# Altium project tms320f28388d_core_board.PrjPcb
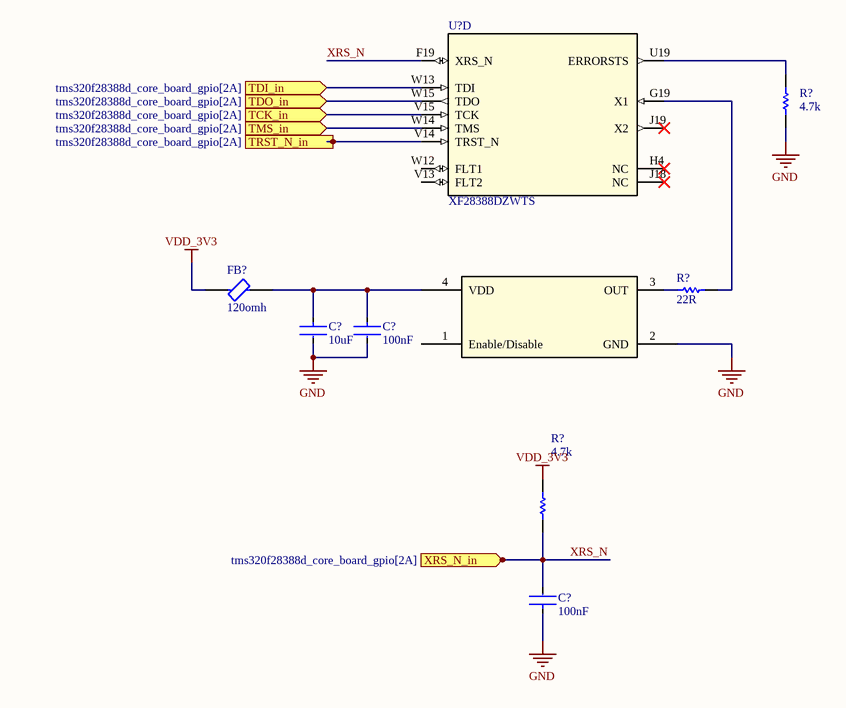
[diagram p0: tms320f28388d_core_board_support.SchDoc]
5 sheets, 167 parts. Net scope: flat (ports and power ports of the same name join across sheets).
Sheets:
  tms320f28388d_core_board_support.SchDoc
  tms320f28388d_core_board_adc.SchDoc
  tms320f28388d_core_board_gpio.SchDoc
  tms320f28388d_core_board_power.SchDoc
  tmf320f28388d_core_board_testpoint.SchDoc

## Sheet tms320f28388d_core_board_support.SchDoc
size A3; SheetNumber: 1; SheetTotal: 5

### Parts
(Parts that share a designator on the sheet are numbered #1, #2 ... from top to bottom, then left to right.)
C?#1  10uF  [FP-CC0402-MFG]
C?#2  100nF  [FP-CC0402-MFG]
C?#3  100nF  [FP-CC0402-MFG]
FB?#1  120omh  [FP-MMZ1005-MFG]
R?#1  4.7k  [FP-RT0402-MFG]
R?#2  22R  [FP-RC0402-0_4-IPC_A]
R?#3  4.7k  [FP-RT0402-MFG]
U?#1  XF28388DZWTS  [ZWT0337A-MFG]  (part D of 8)
X??  ot252020mjba4sl  [OSC-SMD_4P-L2.5-W2.0-BL]  (value not drawn)

### Ports
TCK_in (in, see tms320f28388d_core_board_gpio[2A]), TDI_in (in, see tms320f28388d_core_board_gpio[2A]), TDO_in (in, see tms320f28388d_core_board_gpio[2A]), TMS_in (in, see tms320f28388d_core_board_gpio[2A]), TRST_N_in (in, see tms320f28388d_core_board_gpio[2A]), XRS_N_in (in, see tms320f28388d_core_board_gpio[2A])

### Nets
GND: C?#1.2 C?#2.2 C?#3.1 R?#1.2 X??.2(GND)
VDD_3V3: FB?#1.1 R?#3.1
XRS_N: C?#3.2 R?#3.2 U?#1.F19(XRS_N) ; port XRS_N_in
NetC?#1_1: C?#1.1 C?#2.1 FB?#1.2 X??.4(VDD)
NetR?#1_1: R?#1.1 U?#1.U19(ERRORSTS)
NetR?#2_1: R?#2.1 X??.3(OUT)
NetR?#2_2: R?#2.2 U?#1.G19(X1)
NetU?#1_V14: U?#1.V14(TRST_N) ; port TRST_N_in
NetU?#1_V15: U?#1.V15(TCK) ; port TCK_in
NetU?#1_W13: U?#1.W13(TDI) ; port TDI_in
NetU?#1_W14: U?#1.W14(TMS) ; port TMS_in
NetU?#1_W15: U?#1.W15(TDO) ; port TDO_in

Not connected (* = marked no-connect by the designer): U?#1 H4(NC)* J18(NC)* J19(X2)* V13(FLT2) W12(FLT1); X?? 1(Enable/Disable)

### Library data of the parts
C?#1 = CL05A106MP5NUNC: CAP CER 10UF 10V X5R 0402; Manufacturer: Samsung; Temperature Coefficient: 15%; Tolerance: 20%; Material: Ceramic; Octopart: https://octopart.com/cl05a106mp5nunc-samsung-22457395; Voltage Rating: 10V; RoHS: TRUE; Value: 10uF; Height: 0.7mm; Digikey Description: CAP CER 10UF 10V X5R 0402; Automotive: No; Package: CL05A106MP5NUNC; Device Class L1: Passive Components; Capacitance: 10uF; Temperature Range High: +85°C; ComponentLink2Description: Datasheet; Device Class L2: Capacitors; Temperature Characteristic: X5R; Manufacturer Part Number: CL05A106MP5NUNC; Temperature: -55°C to +85°C; ComponentLink2URL: http://www.samsungsem.com/kr/support/product-search/mlcc/__icsFiles/afieldfile/2019/05/10/19-CL05A106MP5NUNC.pdf; Device Class L3: Ceramic Capacitors; Category: Cap; Temperature Range Low: -55°C; Ipc Land Pattern Name: CAPC10050X50; Lead Free: Yes
C?#2 C?#3 = CC0402KRX7R7BB104: CAP CER 0.1UF 16V X7R 0402; Manufacturer: YAGEO; Material: Ceramic; Automotive Grade: NA; Temperature Coefficient: 30ppm/°C; Tolerance: 0.1; Device Class L1: Passive Components; Temperature Range Low: -55°C; Device Class L3: Ceramic Capacitors; Temperature Characteristic: X7R; Ipc Land Pattern Name: CAPC10050X50; Capacitance: 100 nF; Temperature Range High: +125°C; Voltage Rating: 16 V; Temperature: -55°C to +125°C; RoHS: TRUE; Automotive: No; Height: 0.55mm; Device Class L2: Capacitors; Digikey Description: CAP CER 0.1UF 16V X7R 0402; Package: CC0402; Footprint Url: http://www.yageo.com/exep/pages/download/literatures/UPY-C_GEN_24.pdf; ComponentLink2Description: Datasheet; Category: Cap; Lead Free: Yes; Value: 100 nF; Octopart: https://octopart.com/cc0402krx7r7bb104-yageo-42244624; ComponentLink2URL: http://www.yageo.com/documents/recent/UPY-GP_NP0_16V-to-50V_16.pdf; Manufacturer Part Number: CC0402KRX7R7BB104; Mouser Description: 0402 0.1 uF 16 V ±10 % Tolerance X7R SMT Multilayer Ceramic Capacitor
FB?#1 = MMZ1005S121CT000: Signal Line Ferrite Bead 120Ω @ 100MHz 500mA DCR 220mΩ SMD 0402; DC Resistance (DCR): 250mR; Tolerance: 25%; Impedance: 120R; Series: MMZ; Height: 0.022inch; RoHS Compliant: Yes; Package Quantity: 1; REACH SVHC: No SVHC; Lead Free: Lead Free; Current Rating: 500mA; Packaging: Tape and Reel; Case Code (Imperial): 0402; Width: 0.02inch; Max DC Current: 500mA; Core Material: Ferrite; Case Code (Metric): 1005; Depth: 0.5mm; Case/Package: 0402; Mount: Surface Mount; Length: 0.039inch
R?#1 R?#3 = RT0402BRD074K7L: RES SMD 4.7K OHM 0.1% 1/16W 0402; Manufacturer: Yageo; Voltage Rating: 50V; Temperature Coefficient: 25 ppm/°C; Resistance: 4.7KΩ; Tolerance: 0.001; Power Rating: 0.063W; Value: 4.7KΩ; Device Class L2: Resistors; Composition: Thin Film; Octopart: https://octopart.com/rt0402brd074k7l-yageo-1415343; Mouser Description: Thin Film Resistors 1/16W 4.7K ohm .1% 25ppm; Lead Free: Yes; Height: 0.35mm; Automotive: No; Series: RT; Ipc Land Pattern Name: RESC10050X30; Package: RT0402; Category: Res; Temperature Range High: +155°C; Footprint Url: http://www.yageo.com/exep/pages/download/literatures/PYu-R_Mount_10.pdf; Temperature Range Low: -55°C; Device Class L3: Chip SMD Resistors; Manufacturer Part Number: RT0402BRD074K7L; RoHS: TRUE; ComponentLink2URL: http://www.yageo.com/documents/recent/PYu-RT_1-to-0.01_RoHS_L_9.pdf; Digikey Description: RES SMD 4.7K OHM 0.1% 1/16W 0402; Temperature: -55°C to +155°C; Device Class L1: Passive Components; ComponentLink2Description: Datasheet
R?#2 = CMP-2002-07520-2: Tolerance: 1%; Power Rating: 63mW; Voltage Rating: 50V; Temperature Coefficient: 100ppm/°C; Resistance: 22Ω; Termination: SMD/SMT; Depth: 500µm; Packaging: Tape & Reel; Height: 400µm; Width: 500µm; Case Code (Imperial): 0402; Length: 1mm; Schedule B: 8533210045, 8533210045|8533210045|8533210045|8533210045|8533210045|8533210045|8533210045|8533210045, 8533210045|8533210045|8533210045|8533210045|8533210045|8533210045|8533210045|8533210045|8533210045, 8533210045|8533210045|8533210045|8533210045|8533210045|8533210045|8533210045|8533210045|8533210045|8533210045; Case/Package: 0402; Max Operating Temperature: 155°C; Min Operating Temperature: -55°C; REACH SVHC: Unknown; RoHS: Compliant; Military Standard: Not; Voltage Rating (DC): 50V; Lead Free: Lead Free; Voltage Rating (AC): 50V; Number of Pins: 2; Composition: Thick Film
U?#1 = XF28388DZWTS: C2000 32-bit MCU w/ connectivity manager, 2x C28x+CLA CPU, 1.5 MB flash, FPU64, CLB, ENET, EtherCAT 337-NFBGA -40 to 125; Manufacturer_Name: Texas Instruments; TYPE: TYPE; RefDes: RefDes; Copyright: Copyright (C) 2026 Ultra Librarian. All rights reserved.; Manufacturer_Part_Number: XF28388DZWTS
X?? = OT252020MJBA4SL: 频率:20MHz;常温频差:±10ppm;输出模式:CMOS;工作电压:1.8V~3.3V;工作电流:4mA;频率稳定度:±20ppm;; Manufacturer: YXC(扬兴晶振); AddInBom: yes; ModelId: 6c59bf18646c482ead3932fe5df36485; ModelName: OSC-SMD_4P-L2.5-W2.0-H0.6; ModelTransform: 98.425,78.74,0,0,0,0,0.0005,0,0; Value: 20MHz; Normal temperature Frequency Tolerance: ±10ppm; Output Type: CMOS; Current - Supply: 4mA; Frequency Stability: ±20ppm; Symbol: OT252020MJBA4SL; LCSC Part Name: YSO110TR 20MHZ 1.8V-3.3V ±10PPM -40~85℃（±20PPM) CMOS; SupplierPart: C669067; ManufacturerPart: OT252020MJBA4SL; Supplier Footprint: SMD2520-4P; JLCPCB Part Class: Extended Part; Datasheet: https://item.szlcsc.com/datasheet/OT252020MJBA4SL/699167.html; Supplier: LCSC; ConvertToPcb: yes; FootprintName: OSC-SMD_4P-L2.5-W2.0-BL; Voltage - Supply: 1.8V~3.3V; Operating Temperature: -40℃~+85℃

## Sheet tms320f28388d_core_board_adc.SchDoc
size A3; SheetNumber: 2; SheetTotal: 5
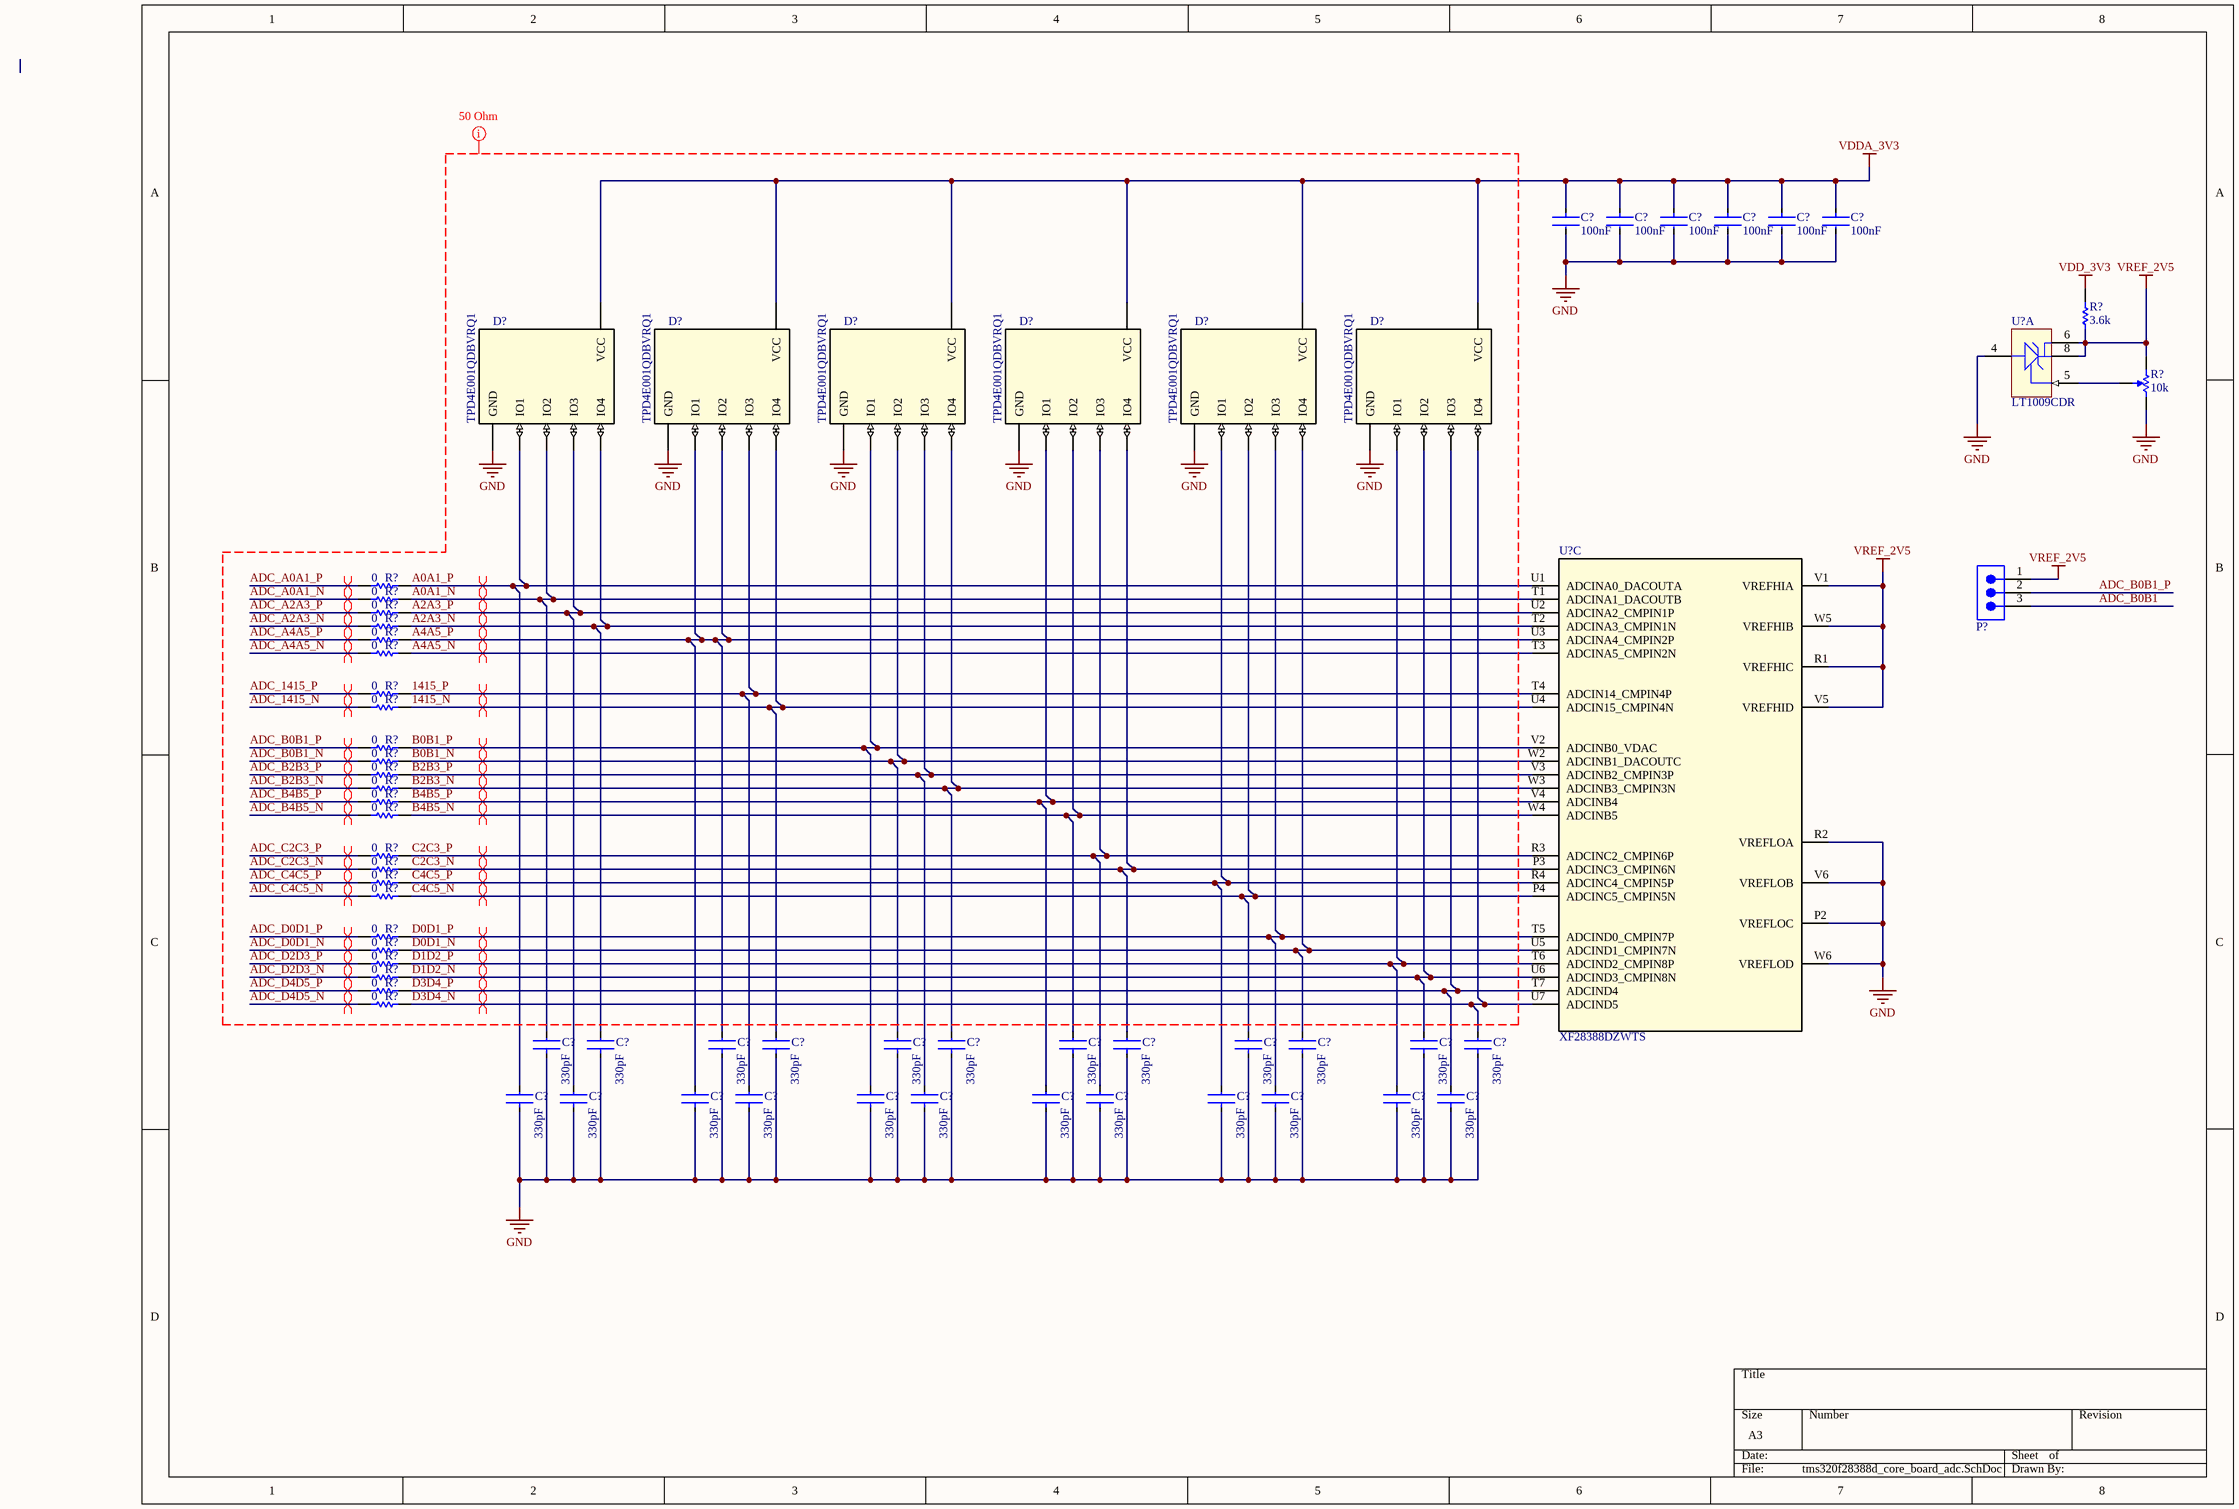
[diagram p1: tms320f28388d_core_board_adc.SchDoc]

### Parts
(Parts that share a designator on the sheet are numbered #1, #2 ... from top to bottom, then left to right.)
C?#4  100nF  [FP-CC0402-MFG]
C?#5  100nF  [FP-CC0402-MFG]
C?#6  100nF  [FP-CC0402-MFG]
C?#7  100nF  [FP-CC0402-MFG]
C?#8  100nF  [FP-CC0402-MFG]
C?#9  100nF  [FP-CC0402-MFG]
C?#10  330pF  [FP-GRM155-0_05-MFG]
C?#11  330pF  [FP-GRM155-0_05-MFG]
C?#12  330pF  [FP-GRM155-0_05-MFG]
C?#13  330pF  [FP-GRM155-0_05-MFG]
C?#14  330pF  [FP-GRM155-0_05-MFG]
C?#15  330pF  [FP-GRM155-0_05-MFG]
C?#16  330pF  [FP-GRM155-0_05-MFG]
C?#17  330pF  [FP-GRM155-0_05-MFG]
C?#18  330pF  [FP-GRM155-0_05-MFG]
C?#19  330pF  [FP-GRM155-0_05-MFG]
C?#20  330pF  [FP-GRM155-0_05-MFG]
C?#21  330pF  [FP-GRM155-0_05-MFG]
C?#22  330pF  [FP-GRM155-0_05-MFG]
C?#23  330pF  [FP-GRM155-0_05-MFG]
C?#24  330pF  [FP-GRM155-0_05-MFG]
C?#25  330pF  [FP-GRM155-0_05-MFG]
C?#26  330pF  [FP-GRM155-0_05-MFG]
C?#27  330pF  [FP-GRM155-0_05-MFG]
C?#28  330pF  [FP-GRM155-0_05-MFG]
C?#29  330pF  [FP-GRM155-0_05-MFG]
C?#30  330pF  [FP-GRM155-0_05-MFG]
C?#31  330pF  [FP-GRM155-0_05-MFG]
C?#32  330pF  [FP-GRM155-0_05-MFG]
C?#33  330pF  [FP-GRM155-0_05-MFG]
D?#1  TPD4E001QDBVRQ1  [FP-DBV0006A-MFG]
D?#2  TPD4E001QDBVRQ1  [FP-DBV0006A-MFG]
D?#3  TPD4E001QDBVRQ1  [FP-DBV0006A-MFG]
D?#4  TPD4E001QDBVRQ1  [FP-DBV0006A-MFG]
D?#5  TPD4E001QDBVRQ1  [FP-DBV0006A-MFG]
D?#6  TPD4E001QDBVRQ1  [FP-DBV0006A-MFG]
P?#1  TSW-103-07-G-S  [SMTC-TSW-103-07-X-S]  (value not drawn)
R?#4  3.6k  [RESC1005X40X25ML05T10]
R?#5  10k  [BOUR-TC33X-2_V]
R?#6  0  [FP-RC0402-0_4-MFG]
R?#7  0  [FP-RC0402-0_4-MFG]
R?#8  0  [FP-RC0402-0_4-MFG]
R?#9  0  [FP-RC0402-0_4-MFG]
R?#10  0  [FP-RC0402-0_4-MFG]
R?#11  0  [FP-RC0402-0_4-MFG]
R?#12  0  [FP-RC0402-0_4-MFG]
R?#13  0  [FP-RC0402-0_4-MFG]
R?#14  0  [FP-RC0402-0_4-MFG]
R?#15  0  [FP-RC0402-0_4-MFG]
R?#16  0  [FP-RC0402-0_4-MFG]
R?#17  0  [FP-RC0402-0_4-MFG]
R?#18  0  [FP-RC0402-0_4-MFG]
R?#19  0  [FP-RC0402-0_4-MFG]
R?#20  0  [FP-RC0402-0_4-MFG]
R?#21  0  [FP-RC0402-0_4-MFG]
R?#22  0  [FP-RC0402-0_4-MFG]
R?#23  0  [FP-RC0402-0_4-MFG]
R?#24  0  [FP-RC0402-0_4-MFG]
R?#25  0  [FP-RC0402-0_4-MFG]
R?#26  0  [FP-RC0402-0_4-MFG]
R?#27  0  [FP-RC0402-0_4-MFG]
R?#28  0  [FP-RC0402-0_4-MFG]
R?#29  0  [FP-RC0402-0_4-MFG]
U?#2  LT1009CDR  [D0008A_N]  (part A of 2)
U?#3  XF28388DZWTS  [ZWT0337A-MFG]  (part C of 8)

### Nets
GND: C?#4.2 C?#5.2 C?#6.2 C?#7.2 C?#8.2 C?#9.2 C?#10.1 C?#11.1 C?#12.1 C?#13.1 C?#14.1 C?#15.1 C?#16.1 C?#17.1 C?#18.1 C?#19.1 C?#20.1 C?#21.1 C?#22.1 C?#23.1 C?#24.1 C?#25.1 C?#26.1 C?#27.1 C?#28.1 C?#29.1 C?#30.1 C?#31.1 C?#32.1 C?#33.1 D?#1.2(GND) D?#2.2(GND) D?#3.2(GND) D?#4.2(GND) D?#5.2(GND) D?#6.2(GND) R?#5.3 U?#2.4(ANODE) U?#3.P2(VREFLOC) U?#3.R2(VREFLOA) U?#3.V6(VREFLOB) U?#3.W6(VREFLOD)
VDD_3V3: R?#4.2
VDDA_3V3: C?#4.1 C?#5.1 C?#6.1 C?#7.1 C?#8.1 C?#9.1 D?#1.5(VCC) D?#2.5(VCC) D?#3.5(VCC) D?#4.5(VCC) D?#5.5(VCC) D?#6.5(VCC)
VREF_2V5: P?#1.1 R?#4.1 R?#5.1 U?#2.6(CATHODE) U?#2.8(CATHODE) U?#3.R1(VREFHIC) U?#3.V1(VREFHIA) U?#3.V5(VREFHID) U?#3.W5(VREFHIB)
1415_N: C?#13.2 D?#2.6(IO4) R?#13.2 U?#3.U4(ADCIN15_CMPIN4N)
1415_P: C?#25.2 D?#2.4(IO3) R?#12.2 U?#3.T4(ADCIN14_CMPIN4P)
A0A1_N: C?#10.2 D?#1.3(IO2) R?#7.2 U?#3.T1(ADCINA1_DACOUTB)
A0A1_P: C?#22.2 D?#1.1(IO1) R?#6.2 U?#3.U1(ADCINA0_DACOUTA)
A2A3_N: C?#11.2 D?#1.6(IO4) R?#9.2 U?#3.T2(ADCINA3_CMPIN1N)
A2A3_P: C?#23.2 D?#1.4(IO3) R?#8.2 U?#3.U2(ADCINA2_CMPIN1P)
A4A5_N: R?#11.2 U?#3.T3(ADCINA5_CMPIN2N)
A4A5_P: C?#12.2 C?#24.2 D?#2.1(IO1) D?#2.3(IO2) R?#10.2 U?#3.U3(ADCINA4_CMPIN2P)
ADC_1415_N: R?#13.1
ADC_1415_P: R?#12.1
ADC_A0A1_N: R?#7.1
ADC_A0A1_P: R?#6.1
ADC_A2A3_N: R?#9.1
ADC_A2A3_P: R?#8.1
ADC_A4A5_N: R?#11.1
ADC_A4A5_P: R?#10.1
ADC_B0B1: P?#1.3
ADC_B0B1_N: R?#15.1
ADC_B0B1_P: P?#1.2 R?#14.1
ADC_B2B3_N: R?#17.1
ADC_B2B3_P: R?#16.1
ADC_B4B5_N: R?#19.1
ADC_B4B5_P: R?#18.1
ADC_C2C3_N: R?#21.1
ADC_C2C3_P: R?#20.1
ADC_C4C5_N: R?#23.1
ADC_C4C5_P: R?#22.1
ADC_D0D1_N: R?#25.1
ADC_D0D1_P: R?#24.1
ADC_D2D3_N: R?#27.1
ADC_D2D3_P: R?#26.1
ADC_D4D5_N: R?#29.1
ADC_D4D5_P: R?#28.1
B0B1_N: C?#14.2 D?#3.3(IO2) R?#15.2 U?#3.W2(ADCINB1_DACOUTC)
B0B1_P: C?#26.2 D?#3.1(IO1) R?#14.2 U?#3.V2(ADCINB0_VDAC)
B2B3_N: C?#15.2 D?#3.6(IO4) R?#17.2 U?#3.W3(ADCINB3_CMPIN3N)
B2B3_P: C?#27.2 D?#3.4(IO3) R?#16.2 U?#3.V3(ADCINB2_CMPIN3P)
B4B5_N: C?#16.2 D?#4.3(IO2) R?#19.2 U?#3.W4(ADCINB5)
B4B5_P: C?#28.2 D?#4.1(IO1) R?#18.2 U?#3.V4(ADCINB4)
C2C3_N: C?#17.2 D?#4.6(IO4) R?#21.2 U?#3.P3(ADCINC3_CMPIN6N)
C2C3_P: C?#29.2 D?#4.4(IO3) R?#20.2 U?#3.R3(ADCINC2_CMPIN6P)
C4C5_N: C?#18.2 D?#5.3(IO2) R?#23.2 U?#3.P4(ADCINC5_CMPIN5N)
C4C5_P: C?#30.2 D?#5.1(IO1) R?#22.2 U?#3.R4(ADCINC4_CMPIN5P)
D0D1_N: C?#19.2 D?#5.6(IO4) R?#25.2 U?#3.U5(ADCIND1_CMPIN7N)
D0D1_P: C?#31.2 D?#5.4(IO3) R?#24.2 U?#3.T5(ADCIND0_CMPIN7P)
D1D2_N: C?#20.2 D?#6.3(IO2) R?#27.2 U?#3.U6(ADCIND3_CMPIN8N)
D1D2_P: C?#32.2 D?#6.1(IO1) R?#26.2 U?#3.T6(ADCIND2_CMPIN8P)
D3D4_N: C?#21.2 D?#6.6(IO4) R?#29.2 U?#3.U7(ADCIND5)
D3D4_P: C?#33.2 D?#6.4(IO3) R?#28.2 U?#3.T7(ADCIND4)
NetR?#5_2: R?#5.2 U?#2.5(ADJ)

### Layout directives
differential pair: 1415_N, 1415_P, A0A1_N, A0A1_P, A2A3_N, A2A3_P, A4A5_N, A4A5_P, ADC_1415_N, ADC_1415_P, ADC_A0A1_N, ADC_A0A1_P, ADC_A2A3_N, ADC_A2A3_P, ADC_A4A5_N, ADC_A4A5_P, ADC_B0B1_N, ADC_B0B1_P, ADC_B2B3_N, ADC_B2B3_P, ADC_B4B5_N, ADC_B4B5_P, ADC_C2C3_N, ADC_C2C3_P, ADC_C4C5_N, ADC_C4C5_P, ADC_D0D1_N, ADC_D0D1_P, ADC_D2D3_N, ADC_D2D3_P, ADC_D4D5_N, ADC_D4D5_P, B0B1_N, B0B1_P, B2B3_N, B2B3_P, B4B5_N, B4B5_P, C2C3_N, C2C3_P, C4C5_N, C4C5_P, D0D1_N, D0D1_P, D1D2_N, D1D2_P, D3D4_N, D3D4_P
mark named 50 Ohm: 1415_N, 1415_P, A0A1_N, A0A1_P, A2A3_N, A2A3_P, A4A5_N, A4A5_P, ADC_1415_N, ADC_1415_P, ADC_A0A1_N, ADC_A0A1_P, ADC_A2A3_N, ADC_A2A3_P, ADC_A4A5_N, ADC_A4A5_P, ADC_B0B1_N, ADC_B0B1_P, ADC_B2B3_N, ADC_B2B3_P, ADC_B4B5_N, ADC_B4B5_P, ADC_C2C3_N, ADC_C2C3_P, ADC_C4C5_N, ADC_C4C5_P, ADC_D0D1_N, ADC_D0D1_P, ADC_D2D3_N, ADC_D2D3_P, ADC_D4D5_N, ADC_D4D5_P, B0B1_N, B0B1_P, B2B3_N, B2B3_P, B4B5_N, B4B5_P, C2C3_N, C2C3_P, C4C5_N, C4C5_P, D0D1_N, D0D1_P, D1D2_N, D1D2_P, D3D4_N, D3D4_P, GND

### Library data of the parts
C?#4-C?#9 = CC0402KRX7R7BB104: as C?#2 on sheet tms320f28388d_core_board_support; Device Class L1: Passive Components; Temperature Range Low: -55°C; Device Class L3: Ceramic Capacitors; Temperature Characteristic: X7R; Ipc Land Pattern Name: CAPC10050X50; Capacitance: 100 nF; Temperature Range High: +125°C; Voltage Rating: 16 V; Temperature: -55°C to +125°C; RoHS: TRUE; Automotive: No; Height: 0.55mm; Device Class L2: Capacitors; Digikey Description: CAP CER 0.1UF 16V X7R 0402; Package: CC0402; Footprint Url: http://www.yageo.com/exep/pages/download/literatures/UPY-C_GEN_24.pdf; ComponentLink2Description: Datasheet; Category: Cap; Lead Free: Yes; Value: 100 nF; Octopart: https://octopart.com/cc0402krx7r7bb104-yageo-42244624; ComponentLink2URL: http://www.yageo.com/documents/recent/UPY-GP_NP0_16V-to-50V_16.pdf; Manufacturer Part Number: CC0402KRX7R7BB104; Mouser Description: 0402 0.1 uF 16 V ±10 % Tolerance X7R SMT Multilayer Ceramic Capacitor
C?#10-C?#33 = GRM1555C1H331JA01D: Chip Multilayer Ceramic Capacitors for General Purpose, 0402, 330pF, C0G, 30ppm/°C, 5%, 50V; Insulation Resistance: 10GR; REACH SVHC: No SVHC; Depth: 0.5mm; Voltage Rating (DC): 50V; Number of Pins: 2; Max Operating Temperature: 125°C; Dielectric: C0G; Tolerance: 5%; Package Quantity: 1; Length: 1mm; Thickness: 0.022inch; Case/Package: 0402; Lead Free: Lead Free; Case Code (Imperial): 0402; Material: Ceramic; Voltage Rating: 50V; Voltage: 50V; Radiation Hardening: No; Min Operating Temperature: -55°C; Packaging: Tape and Reel; Capacitance: 330pF; Case Code (Metric): 1005; Width: 0.5mm; Mount: Surface Mount; Height: 0.5mm; Temperature Coefficient: 30ppm/°C; Termination: SMD/SMT
D?#1-D?#6 = TPD4E001QDBVRQ1: TVS DIODE 5.5V 16V SOT23-6; Power Line Protection: Yes; Breakdown Voltage: 11V; Peak Pulse Power: 100W; Number of Channels: 4; Peak Pulse Current: 5.5A; Current Rating: 1nA; Forward Voltage: 950mV; Direction: Unidirectional; Capacitance: 1.5pF; Leakage Current: 200nA; Interface: LVDS; Operating Supply Voltage: 5.5V; Number of Pins: 6; Lead Free: Lead Free; Max Operating Temperature: 125°C; Length: 3.05mm; RoHS Compliant: Yes; Reverse Standoff Voltage: 5.5V; Depth: 1.75mm; Mount: Surface Mount; Termination: SMD/SMT; Radiation Hardening: No; Min Breakdown Voltage: 11V; Max Power Dissipation: 100W; Clamping Voltage: 16V; Case/Package: SOT-23-6; Min Operating Temperature: -40°C; Packaging: Tape and Reel; Package Quantity: 3000; Working Voltage: 5.5V; Number of Bidirectional Channels: 4; Polarity: Unidirectional
P?#1 = TSW-103-07-G-S: 0.025" SQ Post Header, Through-hole, Vertical, -55 to 125 degC, 2.54 mm Pitch, 3-Pin, Male, RoHS; Manufacturer: Samtec; Pitch: 2.54 mm; ComponentLink3URL: http://www.samtec.com/documents/webfiles/cpdf/TSW-XXX-XX-XXX-X-XX-XXX-MKT.pdf; Temperature Range: -55 to 125 degC; DatasheetVersion: F-214; ComponentLink1Description: Manufacturer URL; ComponentLink2URL: http://www.samtec.com/documents/webfiles/pdf/TSW_TH.PDF; RoHS: True; Orientation: Vertical; ComponentLink2Description: Datasheet; ComponentLink3Description: Package Specification; PackageDescription: .025[0.64] SQ. Post Terminal Strip Assembly; Mounting Technology: Through-hole; PackageVersion: DM, 8/1988; ComponentLink1URL: http://www.samtec.com; PackageReference: TSW-103-07-X-S; PartNumber: TSW-103-07-G-S
R?#4 = RC0402FR-073K6L: Manufacturer: Yageo / Phycomp; Part Number: RC0402FR-073K6L
R?#5 = TC33X-2-103E: Trimming Potentiometer, 10000 Ohm, -40 to 100 degC, 3-Pin SMD, RoHS, Tape and Reel; Manufacturer: Bourns; Tolerance: 25%; Max Power Dissipation: 100mW; Number of Turns: 1; Resistance: 10KOhm; Temperature Coefficient: 250ppm/degreesC; Voltage Rating (DC): 50V; Datasheet URL: http://www.bourns.com/docs/Product-Datasheets/TC33.pdf; Composition: Potentiometer; Package Description: 3-Pin Surface Mount Device, Body 3.8 x 3.6 mm; Weight: 29.4mg; Power Rating: 100mW; Termination: FootPrint; Manufacturer URL: http://www.bourns.com/; Width: 0.118inch; Height: 0.047inch; Military Standard: Not; Radiation Hardening: No; Colour: Silver; Case/Package: SMD/SMT; Depth: 3.8mm; Min Operating Temperature: -40degC; Lead Free: LeadFree; Datasheet Version: 42583.0; REACH SVHC: NoSVHC; Length: 3mm; RoHSCompliant: true; Contact Plating: Silver; Taper: Linear; Packaging: TapeandReel; Mount: SurfaceMount; Max Operating Temperature: 100degC; Package Reference: TC33X-2; Package Quantity: 2500
R?#6-R?#29 = RC0402FR-070RL: RES SMD 0 OHM JUMPER 1/16W 0402; Resistance: 0R; Temperature Coefficient: 200ppm/°C; Tolerance: 1%; Power Rating: 62.5mW; Voltage Rating: 50V; Max Power Dissipation: 63mW; Features: Moisture Resistant; Length: 1mm; Case Code (Metric): 1005; Series: RC; RoHS Compliant: Yes; Resistor Type: Thick Film; Height: 0.35mm; Min Operating Temperature: -55°C; Case Code (Imperial): 0402; Number of Terminations: 2; Contact Plating: Tin; Case/Package: 0402; Size Code: 0402; Termination: SMD/SMT; Max Operating Temperature: 155°C; Width: 0.5mm; Mount: Surface Mount; Lead Free: Lead Free; Packaging: Tape and Reel; Radiation Hardening: No
U?#2 = LT1009CDR: Integrated Reference Circuit, 2.5 V, 15 ppm / degC, 10 mA, 0 to 70 degC, 8-pin SOIC (D), Green (RoHS & no Sb/Br); Manufacturer: Texas Instruments; VO(V): 2.5; Initial Accuracy @ 25/deg C(%): 0.2; SubFamily: Shunt Voltage Reference; Temp Coeff(Typ)(ppm/ degree C): 15; Min Iz for Regulation(uA): 400; Rating: Catalog; Iout/Iz(Max)(mA): 10; Temp Coeff(Max)(ppm/ degree C): 25; ComponentLink3Description: Package Specification; ComponentLink1URL: http://www.ti.com/; ComponentLink2URL: http://www.ti.com/general/docs/lit/getliterature.tsp?genericPartNumber=LT1009&fileType=pdf; DatasheetVersion: SLVS013N; PackageDescription: 8-Pin Plastic Small Outline, Body 4.9 x 3.9 mm, Pitch 1.27 mm; ComponentLink1Description: Manufacturer URL; PackageReference: D0008A; ComponentLink2Description: Datasheet; PartNumber: LT1009CDR; Mounting Technology: Surface Mount; Eco-Plan: Green (RoHS & no Sb/Br); PackageVersion: 4040047-3/M; Code_JEDEC: MS-012; ComponentLink3URL: http://www.ti.com/litv/pdf/msoi002j
U?#3 = XF28388DZWTS: as U?#1 on sheet tms320f28388d_core_board_support; TYPE: TYPE; RefDes: RefDes; Copyright: Copyright (C) 2026 Ultra Librarian. All rights reserved.; Manufacturer_Part_Number: XF28388DZWTS

## Sheet tms320f28388d_core_board_gpio.SchDoc
size A3; SheetNumber: 3; SheetTotal: 5
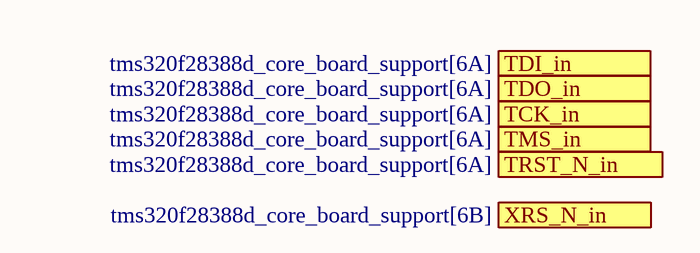
[diagram p2: tms320f28388d_core_board_gpio.SchDoc]

### Ports
TCK_in (out, see tms320f28388d_core_board_support[6A]), TDI_in (out, see tms320f28388d_core_board_support[6A]), TDO_in (out, see tms320f28388d_core_board_support[6A]), TMS_in (out, see tms320f28388d_core_board_support[6A]), TRST_N_in (out, see tms320f28388d_core_board_support[6A]), XRS_N_in (out, see tms320f28388d_core_board_support[6B])

## Sheet tms320f28388d_core_board_power.SchDoc
size A3; SheetNumber: 4; SheetTotal: 5
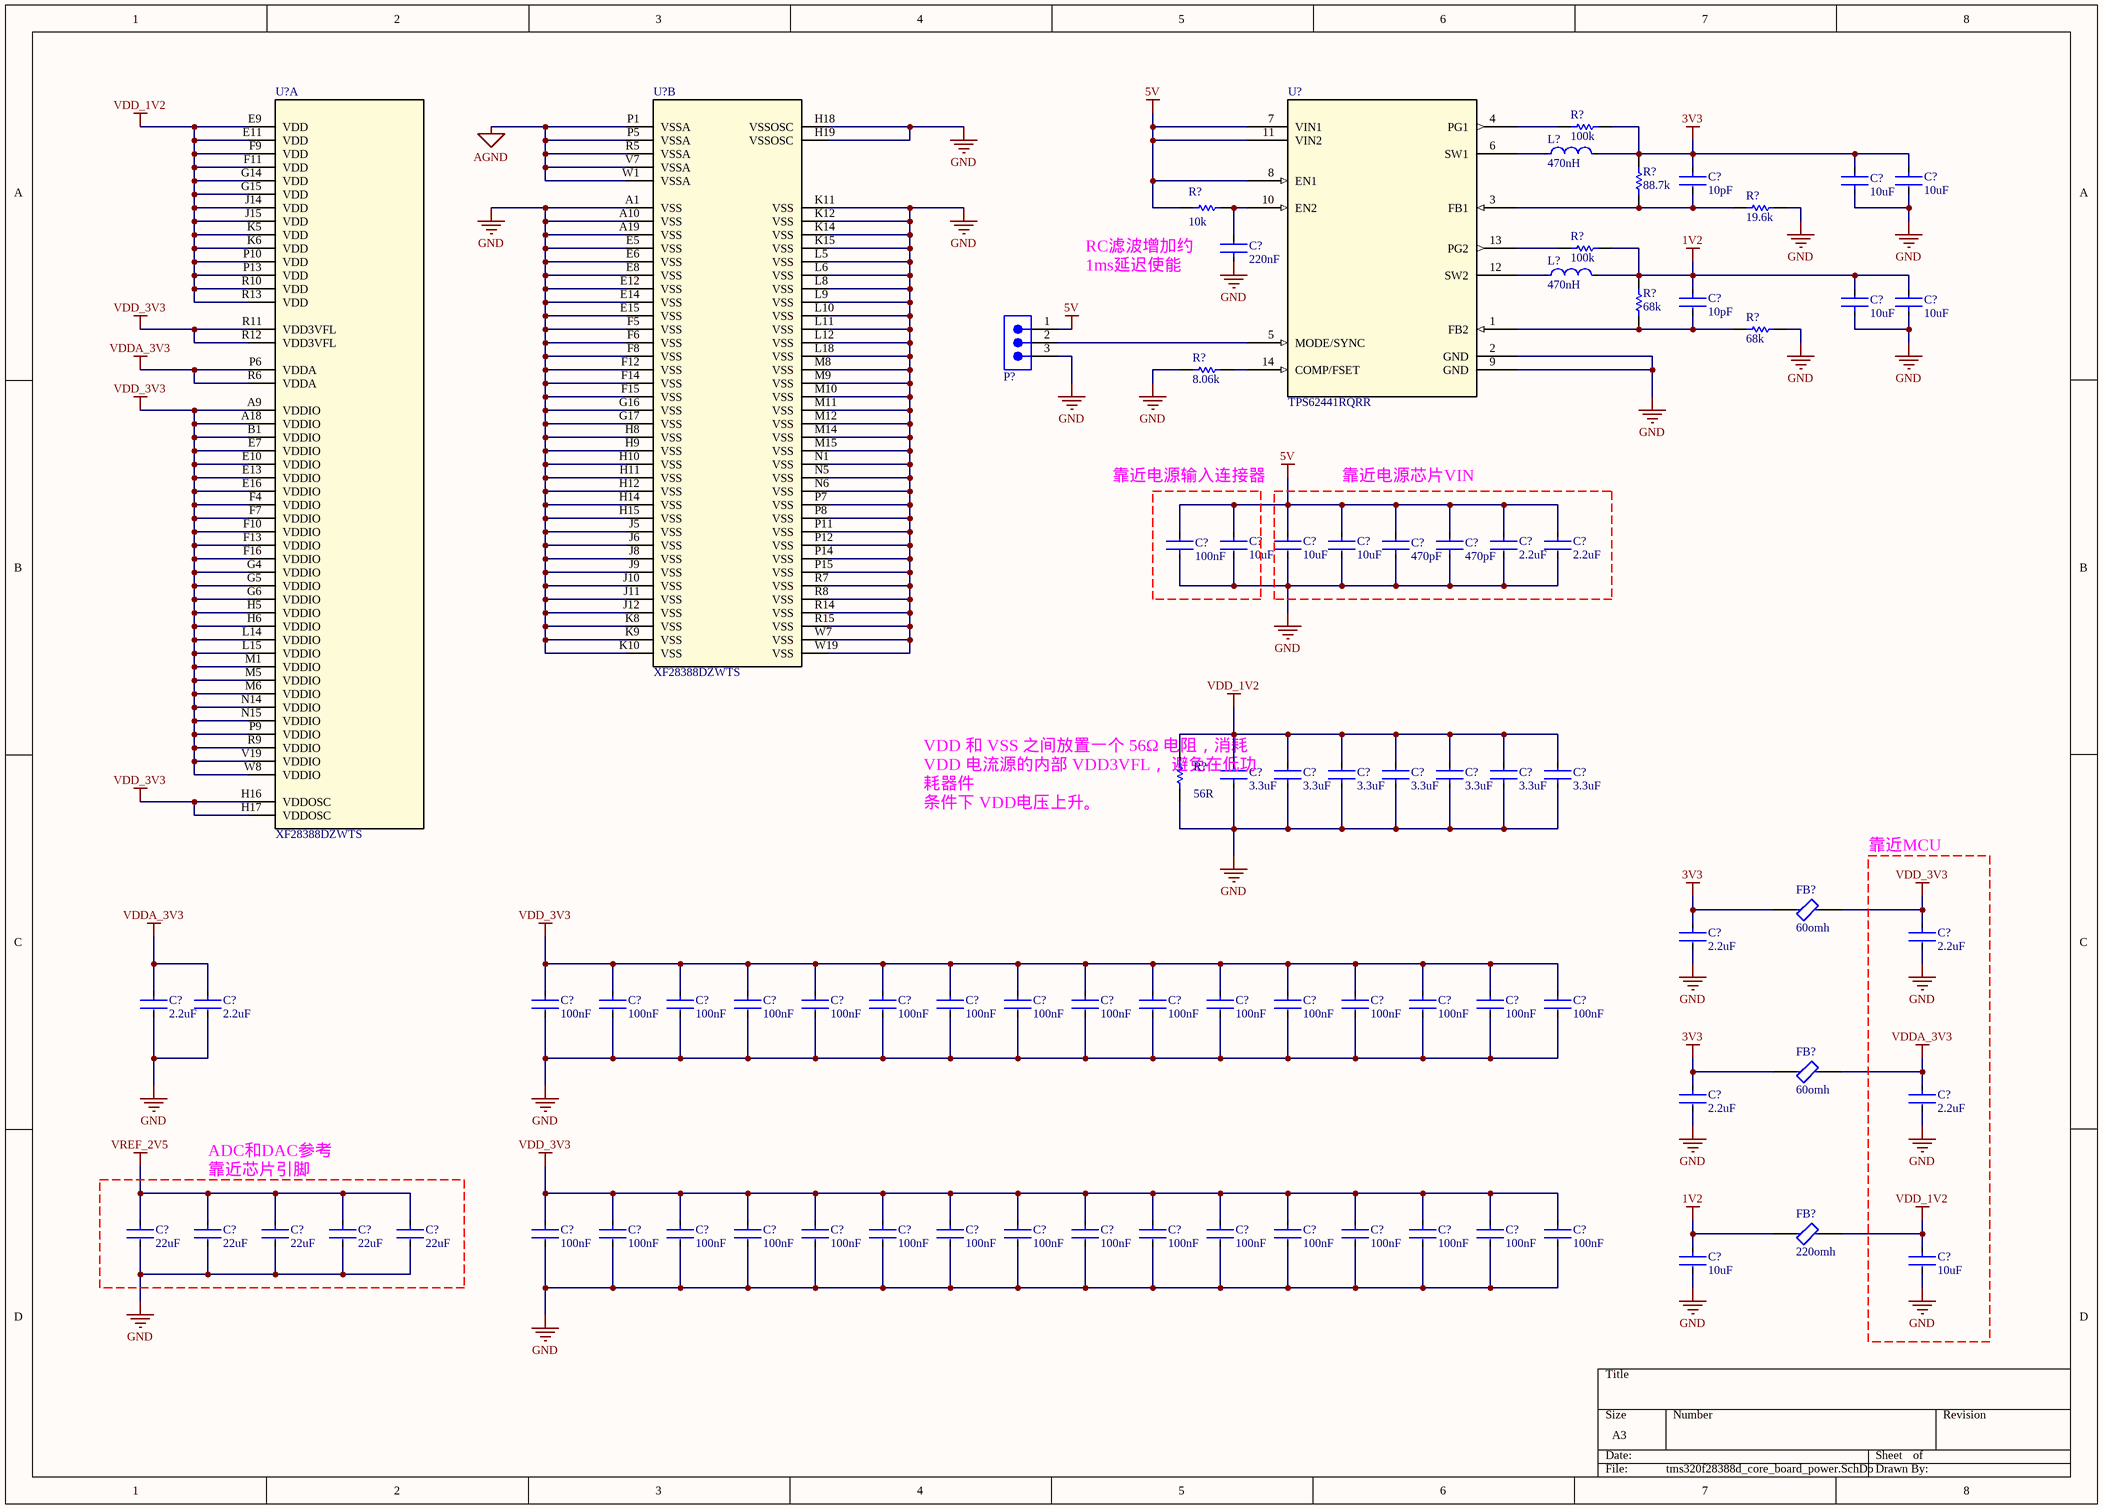
[diagram p3: tms320f28388d_core_board_power.SchDoc]

### Parts
(Parts that share a designator on the sheet are numbered #1, #2 ... from top to bottom, then left to right.)
C?#34  10pF  [FP-GCM155-0_05-MFG]
C?#35  10uF  [FP-GRM188-0_2-MFG]
C?#36  10uF  [FP-GRM188-0_2-MFG]
C?#37  220nF  [FP-GRM155-0_05-MFG]
C?#38  10pF  [FP-GCM155-0_05-MFG]
C?#39  10uF  [FP-GRM188-0_2-MFG]
C?#40  10uF  [FP-GRM188-0_2-MFG]
C?#41  10uF  [FP-GRM188-0_2-MFG]
C?#42  10uF  [FP-GRM188-0_2-MFG]
C?#43  10uF  [FP-GRM188-0_2-MFG]
C?#44  2.2uF  [FP-GRM188-0_1-e0_2_0_5-MFG]
C?#45  2.2uF  [FP-GRM188-0_1-e0_2_0_5-MFG]
C?#46  100nF  [FP-CC0402-MFG]
C?#47  470pF  [FP-0402-L_1_0_1-W_0_5_0_1-MFG]
C?#48  470pF  [FP-0402-L_1_0_1-W_0_5_0_1-MFG]
C?#49  3.3uF  [FP-CC0402-MFG]
C?#50  3.3uF  [FP-CC0402-MFG]
C?#51  3.3uF  [FP-CC0402-MFG]
C?#52  3.3uF  [FP-CC0402-MFG]
C?#53  3.3uF  [FP-CC0402-MFG]
C?#54  3.3uF  [FP-CC0402-MFG]
C?#55  3.3uF  [FP-CC0402-MFG]
C?#56  2.2uF  [FP-CC0402-MFG]
C?#57  2.2uF  [FP-CC0402-MFG]
C?#58  2.2uF  [FP-CC0402-MFG]
C?#59  2.2uF  [FP-CC0402-MFG]
C?#60  100nF  [FP-CC0402-MFG]
C?#61  100nF  [FP-CC0402-MFG]
C?#62  100nF  [FP-CC0402-MFG]
C?#63  100nF  [FP-CC0402-MFG]
C?#64  100nF  [FP-CC0402-MFG]
C?#65  100nF  [FP-CC0402-MFG]
C?#66  100nF  [FP-CC0402-MFG]
C?#67  100nF  [FP-CC0402-MFG]
C?#68  100nF  [FP-CC0402-MFG]
C?#69  100nF  [FP-CC0402-MFG]
C?#70  100nF  [FP-CC0402-MFG]
C?#71  100nF  [FP-CC0402-MFG]
C?#72  100nF  [FP-CC0402-MFG]
C?#73  100nF  [FP-CC0402-MFG]
C?#74  100nF  [FP-CC0402-MFG]
C?#75  100nF  [FP-CC0402-MFG]
C?#76  2.2uF  [FP-CC0402-MFG]
C?#77  2.2uF  [FP-CC0402-MFG]
C?#78  22uF  [FP-GRM158-0_2-MFG]
C?#79  22uF  [FP-GRM158-0_2-MFG]
C?#80  22uF  [FP-GRM158-0_2-MFG]
C?#81  22uF  [FP-GRM158-0_2-MFG]
C?#82  22uF  [FP-GRM158-0_2-MFG]
C?#83  100nF  [FP-CC0402-MFG]
C?#84  100nF  [FP-CC0402-MFG]
C?#85  100nF  [FP-CC0402-MFG]
C?#86  100nF  [FP-CC0402-MFG]
C?#87  100nF  [FP-CC0402-MFG]
C?#88  100nF  [FP-CC0402-MFG]
C?#89  100nF  [FP-CC0402-MFG]
C?#90  100nF  [FP-CC0402-MFG]
C?#91  100nF  [FP-CC0402-MFG]
C?#92  100nF  [FP-CC0402-MFG]
C?#93  100nF  [FP-CC0402-MFG]
C?#94  100nF  [FP-CC0402-MFG]
C?#95  100nF  [FP-CC0402-MFG]
C?#96  100nF  [FP-CC0402-MFG]
C?#97  100nF  [FP-CC0402-MFG]
C?#98  100nF  [FP-CC0402-MFG]
C?#99  10uF  [FP-CC0402-MFG]
C?#100  10uF  [FP-CC0402-MFG]
FB?#2  60omh  [FP-BLM15-0_05-d0_7-MFG]
FB?#3  60omh  [FP-BLM15-0_05-d0_7-MFG]
FB?#4  220omh  [FP-BLM15-0_05-MFG]
L?#1  470nH  [FP-DFE252012C-MFG]
L?#2  470nH  [FP-DFE252012C-MFG]
P?#2  TSW-103-07-G-S  [SMTC-TSW-103-07-X-S]  (value not drawn)
R?#30  100k  [RESC1005X40X25NL05T10]
R?#31  88.7k  [RESC1005X40X25NL05T05]
R?#32  19.6k  [RESC1005X40X25NL05T05]
R?#33  10k  [FP-RT0402-MFG]
R?#34  100k  [RESC1005X40X25NL05T10]
R?#35  68k  [RESC1005X40X25NL05T05]
R?#36  68k  [RESC1005X40X25NL05T05]
R?#37  8.06k  [RESC1005X40X25NL05T05]
R?#38  56R  [FP-RT0402-MFG]
U?#4  XF28388DZWTS  [ZWT0337A-MFG]  (part A of 8)
U?#5  XF28388DZWTS  [ZWT0337A-MFG]  (part B of 8)
U?#6  TPS62441RQRR  [VQFN-HR14_RQR_TEX]

### Nets
1V2: C?#38.1 C?#39.2 C?#40.2 C?#99.1 FB?#4.1 L?#2.2 R?#34.1 R?#35.2
3V3: C?#34.1 C?#35.1 C?#36.2 C?#56.1 C?#76.1 FB?#2.1 FB?#3.1 L?#1.2 R?#30.1 R?#31.2
5V: C?#41.1 C?#42.1 C?#43.1 C?#44.1 C?#45.1 C?#46.2 C?#47.2 C?#48.2 P?#2.1 R?#33.2 U?#6.7(VIN1) U?#6.8(EN1) U?#6.11(VIN2)
AGND: U?#5.P1(VSSA) U?#5.P5(VSSA) U?#5.R5(VSSA) U?#5.V7(VSSA) U?#5.W1(VSSA)
GND: C?#35.2 C?#36.1 C?#37.1 C?#39.1 C?#40.1 C?#41.2 C?#42.2 C?#43.2 C?#44.2 C?#45.2 C?#46.1 C?#47.1 C?#48.1 C?#49.1 C?#50.1 C?#51.1 C?#52.1 C?#53.1 C?#54.1 C?#55.1 C?#56.2 C?#57.2 C?#58.2 C?#59.2 C?#60.2 C?#61.2 C?#62.2 C?#63.2 C?#64.2 C?#65.2 C?#66.2 C?#67.2 C?#68.2 C?#69.2 C?#70.2 C?#71.2 C?#72.2 C?#73.2 C?#74.2 C?#75.2 C?#76.2 C?#77.2 C?#78.2 C?#79.2 C?#80.2 C?#81.2 C?#82.2 C?#83.2 C?#84.2 C?#85.2 C?#86.2 C?#87.2 C?#88.2 C?#89.2 C?#90.2 C?#91.2 C?#92.2 C?#93.2 C?#94.2 C?#95.2 C?#96.2 C?#97.2 C?#98.2 C?#99.2 C?#100.2 P?#2.3 R?#32.2 R?#36.2 R?#37.2 R?#38.2 U?#5.A1(VSS) U?#5.A10(VSS) U?#5.A19(VSS) U?#5.E5(VSS) U?#5.E6(VSS) U?#5.E8(VSS) U?#5.E12(VSS) U?#5.E14(VSS) U?#5.E15(VSS) U?#5.F5(VSS) U?#5.F6(VSS) U?#5.F8(VSS) U?#5.F12(VSS) U?#5.F14(VSS) U?#5.F15(VSS) U?#5.G16(VSS) U?#5.G17(VSS) U?#5.H8(VSS) U?#5.H9(VSS) U?#5.H10(VSS) U?#5.H11(VSS) U?#5.H12(VSS) U?#5.H14(VSS) U?#5.H15(VSS) U?#5.H18(VSSOSC) U?#5.H19(VSSOSC) U?#5.J5(VSS) U?#5.J6(VSS) U?#5.J8(VSS) U?#5.J9(VSS) U?#5.J10(VSS) U?#5.J11(VSS) U?#5.J12(VSS) U?#5.K8(VSS) U?#5.K9(VSS) U?#5.K10(VSS) U?#5.K11(VSS) U?#5.K12(VSS) U?#5.K14(VSS) U?#5.K15(VSS) U?#5.L5(VSS) U?#5.L6(VSS) U?#5.L8(VSS) U?#5.L9(VSS) U?#5.L10(VSS) U?#5.L11(VSS) U?#5.L12(VSS) U?#5.L18(VSS) U?#5.M8(VSS) U?#5.M9(VSS) U?#5.M10(VSS) U?#5.M11(VSS) U?#5.M12(VSS) U?#5.M14(VSS) U?#5.M15(VSS) U?#5.N1(VSS) U?#5.N5(VSS) U?#5.N6(VSS) U?#5.P7(VSS) U?#5.P8(VSS) U?#5.P11(VSS) U?#5.P12(VSS) U?#5.P14(VSS) U?#5.P15(VSS) U?#5.R7(VSS) U?#5.R8(VSS) U?#5.R14(VSS) U?#5.R15(VSS) U?#5.W7(VSS) U?#5.W19(VSS) U?#6.2(GND) U?#6.9(GND)
VDD_1V2: C?#49.2 C?#50.2 C?#51.2 C?#52.2 C?#53.2 C?#54.2 C?#55.2 C?#100.1 FB?#4.2 R?#38.1 U?#4.E9(VDD) U?#4.E11(VDD) U?#4.F9(VDD) U?#4.F11(VDD) U?#4.G14(VDD) U?#4.G15(VDD) U?#4.J14(VDD) U?#4.J15(VDD) U?#4.K5(VDD) U?#4.K6(VDD) U?#4.P10(VDD) U?#4.P13(VDD) U?#4.R10(VDD) U?#4.R13(VDD)
VDD_3V3: C?#57.1 C?#60.1 C?#61.1 C?#62.1 C?#63.1 C?#64.1 C?#65.1 C?#66.1 C?#67.1 C?#68.1 C?#69.1 C?#70.1 C?#71.1 C?#72.1 C?#73.1 C?#74.1 C?#75.1 C?#83.1 C?#84.1 C?#85.1 C?#86.1 C?#87.1 C?#88.1 C?#89.1 C?#90.1 C?#91.1 C?#92.1 C?#93.1 C?#94.1 C?#95.1 C?#96.1 C?#97.1 C?#98.1 FB?#2.2 U?#4.A9(VDDIO) U?#4.A18(VDDIO) U?#4.B1(VDDIO) U?#4.E7(VDDIO) U?#4.E10(VDDIO) U?#4.E13(VDDIO) U?#4.E16(VDDIO) U?#4.F4(VDDIO) U?#4.F7(VDDIO) U?#4.F10(VDDIO) U?#4.F13(VDDIO) U?#4.F16(VDDIO) U?#4.G4(VDDIO) U?#4.G5(VDDIO) U?#4.G6(VDDIO) U?#4.H5(VDDIO) U?#4.H6(VDDIO) U?#4.H16(VDDOSC) U?#4.H17(VDDOSC) U?#4.L14(VDDIO) U?#4.L15(VDDIO) U?#4.M1(VDDIO) U?#4.M5(VDDIO) U?#4.M6(VDDIO) U?#4.N14(VDDIO) U?#4.N15(VDDIO) U?#4.P9(VDDIO) U?#4.R9(VDDIO) U?#4.R11(VDD3VFL) U?#4.R12(VDD3VFL) U?#4.V19(VDDIO) U?#4.W8(VDDIO)
VDDA_3V3: C?#58.1 C?#59.1 C?#77.1 FB?#3.2 U?#4.P6(VDDA) U?#4.R6(VDDA)
VREF_2V5: C?#78.1 C?#79.1 C?#80.1 C?#81.1 C?#82.1
NetC?#34_2: C?#34.2 R?#31.1 R?#32.1 U?#6.3(FB1)
NetC?#37_2: C?#37.2 R?#33.1 U?#6.10(EN2)
NetC?#38_2: C?#38.2 R?#35.1 R?#36.1 U?#6.1(FB2)
NetL?#1_1: L?#1.1 U?#6.6(SW1)
NetL?#2_1: L?#2.1 U?#6.12(SW2)
NetP?#2_2: P?#2.2 U?#6.5(MODE/SYNC)
NetR?#30_2: R?#30.2 U?#6.4(PG1)
NetR?#34_2: R?#34.2 U?#6.13(PG2)
NetR?#37_1: R?#37.1 U?#6.14(COMP/FSET)

### Notes on the sheet
- RC滤波增加约1ms延迟使能
- (near C?#46) 靠近电源输入连接器
- (near C?#47) 靠近电源芯片VIN
- VDD 和 VSS 之间放置一个 56Ω 电阻，消耗 VDD 电流源的内部 VDD3VFL， 避免在低功耗器件
  条件下 VDD电压上升。
- 靠近MCU
- (near C?#79) ADC和DAC参考靠近芯片引脚

### Library data of the parts
C?#34 C?#38 = GCM1555C1H100JA16D: Ceramic Capacitor for Automotive 10pF ±5% 50VDC C0G 0402 Paper T/R; Voltage Rating: 50V; Case/Package: 0402; Dielectric: C0G; Package Quantity: 10000; Ratings: AEC-Q200; Max Operating Temperature: 125°C; Width: 0.02inch; REACH SVHC: No SVHC; Mount: Surface Mount; Min Operating Temperature: -55°C; Lead Free: Lead Free; Packaging: Tape and Reel; Capacitance: 10pF; Case Code (Imperial): 0402; Tolerance: 5%; Height: 0.5mm; Thickness: 0.022inch; Length: 0.039inch; Case Code (Metric): 1005; Weight: 0.000212oz; Voltage Rating (DC): 50V; Termination: SMD/SMT
C?#35 C?#36 C?#39-C?#43 = GRM188Z71A106MA73D: Chip Multilayer Ceramic Capacitors for General Purpose, 0603, 10uF, X7R, 15%, 20%, 10V; Case/Package: 0603
C?#37 = GRM155R61H224KE01D: Multilayer Ceramic Capacitor 0.22uF 10% 50V X5R 0402 Paper T/R
C?#44 C?#45 = GRM188C70J225KE20D: Chip Multilayer Ceramic Capacitors for General Purpose, 0603, 2.2uF, X7S, 22%, 10%, 6.3V; Thickness: 0.035inch; Length: 1.6mm; Packaging: Tape and Reel; Tolerance: 10%; Number of Pins: 2; Depth: 0.8mm; Voltage Rating: 6.3V; Voltage Rating (DC): 6.3V; Lead Pitch: 0.5mm; Dielectric: X7S; Case Code (Imperial): 0603; Weight: 7.1E-05oz; Min Operating Temperature: -55°C; Width: 0.031inch; Termination: SMD/SMT; Height: 0.8mm; REACH SVHC: No SVHC; Radiation Hardening: No; Case Code (Metric): 1608; Mount: Surface Mount; Package Quantity: 4000; Max Operating Temperature: 125°C; Case/Package: 0603; Capacitance: 2.2uF
C?#46 C?#60-C?#75 C?#83-C?#98 = CC0402KRX7R7BB104: as C?#2 on sheet tms320f28388d_core_board_support; Device Class L1: Passive Components; Temperature Range Low: -55°C; Device Class L3: Ceramic Capacitors; Temperature Characteristic: X7R; Ipc Land Pattern Name: CAPC10050X50; Capacitance: 100 nF; Temperature Range High: +125°C; Voltage Rating: 16 V; Temperature: -55°C to +125°C; RoHS: TRUE; Automotive: No; Height: 0.55mm; Device Class L2: Capacitors; Digikey Description: CAP CER 0.1UF 16V X7R 0402; Package: CC0402; Footprint Url: http://www.yageo.com/exep/pages/download/literatures/UPY-C_GEN_24.pdf; ComponentLink2Description: Datasheet; Category: Cap; Lead Free: Yes; Value: 100 nF; Octopart: https://octopart.com/cc0402krx7r7bb104-yageo-42244624; ComponentLink2URL: http://www.yageo.com/documents/recent/UPY-GP_NP0_16V-to-50V_16.pdf; Manufacturer Part Number: CC0402KRX7R7BB104; Mouser Description: 0402 0.1 uF 16 V ±10 % Tolerance X7R SMT Multilayer Ceramic Capacitor
C?#47 C?#48 = CC0402KRX7R9BB471: General Purpose Ceramic Capacitor, 0402, 470pF, 10%, X7R, 15%, 50V; Series: -; Height: 0.5mm; Termination: SMD/SMT; Packaging: Tape and Reel; Tolerance: 10%; REACH SVHC: No SVHC; Package Quantity: 10000; Case Code (Imperial): 0402; Voltage: 50V; Depth: 0.5mm; Case Code (Metric): 1005; Voltage Rating: 50V; Radiation Hardening: No; Construction: Flat; Mount: Surface Mount; Dielectric: X7R; Min Operating Temperature: -55°C; Width: 0.5mm; Number of Pins: 2; Case/Package: 0402; RoHS Compliant: Yes; Thickness: 0.022inch; Lead Free: Lead Free; Voltage Rating (DC): 50V; Max Operating Temperature: 125°C; Capacitance: 470pF; Length: 1mm; Contact Plating: Tin
C?#49-C?#55 = C0402C335M7PACTU: Manufacturer: Kemet; Part Number: C0402C335M7PACTU
C?#56-C?#59 C?#76 C?#77 = CC0402KRX5R6BB225: CAP CER 2.2UF 10V X5R 0402; Manufacturer: YAGEO; Automotive Grade: NA; Temperature Coefficient: 30ppm/°C; Tolerance: 0.1; Material: Ceramic; Automotive: No; Device Class L1: Passive Components; Footprint Url: http://www.yageo.com/exep/pages/download/literatures/UPY-C_GEN_24.pdf; Height: 0.55mm; Temperature Range High: +125°C; Category: Cap; ComponentLink2Description: Datasheet; Lead Free: Yes; Octopart: https://octopart.com/cc0402krx5r6bb225-yageo-30987418; Value: 2.2 uF; Ipc Land Pattern Name: CAPC10050X50; Device Class L3: Ceramic Capacitors; Temperature Characteristic: X5R; Device Class L2: Capacitors; Package: CC0402; RoHS: TRUE; Capacitance: 2.2 uF; Temperature: -55°C to +125°C; Digikey Description: CAP CER 2.2UF 10V X5R 0402; Mouser Description: CC Series 0402 2.2 uF 10 V ±10% Tolerance X5R Multilayer Ceramic Capacitor; Voltage Rating: 10 V; Manufacturer Part Number: CC0402KRX5R6BB225; ComponentLink2URL: http://www.yageo.com/documents/recent/UPY-GP_NP0_16V-to-50V_16.pdf; Temperature Range Low: -55°C
C?#78-C?#82 = GRM158C80G226ME01D: Chip Multilayer Ceramic Capacitors for General Purpose, 0402, 22uF, X6S, 22%, 20%, 4V
C?#99 C?#100 = CL05A106MP5NUNC: as C?#1 on sheet tms320f28388d_core_board_support; Octopart: https://octopart.com/cl05a106mp5nunc-samsung-22457395; Voltage Rating: 10V; RoHS: TRUE; Value: 10uF; Height: 0.7mm; Digikey Description: CAP CER 10UF 10V X5R 0402; Automotive: No; Package: CL05A106MP5NUNC; Device Class L1: Passive Components; Capacitance: 10uF; Temperature Range High: +85°C; ComponentLink2Description: Datasheet; Device Class L2: Capacitors; Temperature Characteristic: X5R; Manufacturer Part Number: CL05A106MP5NUNC; Temperature: -55°C to +85°C; ComponentLink2URL: http://www.samsungsem.com/kr/support/product-search/mlcc/__icsFiles/afieldfile/2019/05/10/19-CL05A106MP5NUNC.pdf; Device Class L3: Ceramic Capacitors; Category: Cap; Temperature Range Low: -55°C; Ipc Land Pattern Name: CAPC10050X50; Lead Free: Yes
FB?#2 FB?#3 = BLM15PD600SN1D: Chip Ferrite Bead, 0402, 60Ω @ 100MHz, 0.06Ω, 25%, 1.7A; Number of Circuits: 1; DC Resistance (DCR): 60mR; Material: Steel; Impedance: 60R; Test Frequency: 100MHz; Lead Free: Lead Free; Radiation Hardening: No; Min Operating Temperature: -55°C; Case Code (Metric): 1005; Series: BLM15PD; Max Current Rating: 1.7A; Length: 1mm; Tolerance: 25%; Current Rating: 1.7A; RoHS Compliant: Yes; DC Current: 1.7A; Width: 0.5mm; Core Material: Ferrite; Number of Pins: 2; Depth: 0.55mm; Case Code (Imperial): 0402; Number of Lines: 1; Package Quantity: 1; Max Operating Temperature: 125°C; Case/Package: 0402; Termination: SMD/SMT; Packaging: Tape and Reel; Height: 0.5mm; Military Standard: Not; REACH SVHC: No SVHC; Max DC Current: 1.7A; DC Resistance-Max: 60MR
FB?#4 = BLM15AG221SN1D: Chip Ferrite Bead, 0402, 220Ω @ 100MHz, 0.29Ω, 25%, 450mA; Impedance: 220R; Shielding: Unshielded; Number of Lines: 1; DC Resistance (DCR): 290mR; DC Current: 300mA; Resistance: 350mR; Material: Steel; Radiation Hardening: No; Number of Pins: 2; REACH SVHC: No SVHC; Min Operating Temperature: -55°C; Width: 0.5mm; Lead Free: Lead Free; Case/Package: 0402; Case Code (Imperial): 0402; Max Current Rating: 450mA; Max Operating Temperature: 125°C; Length: 1mm; Tolerance: 25%; Current Rating: 450mA; Core Material: Ferrite; Depth: 0.55mm; Max DC Current: 300mA; Military Standard: Not; Termination: SMD/SMT; Height: 0.5mm; Packaging: Tape and Reel; Package Quantity: 1; Test Frequency: 100MHz; Number of Circuits: 1; RoHS Compliant: Yes; Case Code (Metric): 1005
L?#1 L?#2 = DFE252012P-R47M=P2: Shielded Wirewound Inductor 0.47uH 20% 4000mA 0.027Ω 1008 (2520); Test Frequency: 1MHz; Max DC Current: 4A; DC Resistance (DCR): 27mR; Core Material: Ferrite; Current Rating: 5.7A; Min Operating Temperature: -40°C; Depth: 2mm; Case/Package: 1008; Width: 0.079inch; Length: 0.098inch; Max Operating Temperature: 125°C; Tolerance: 20%; Case Code (Imperial): 1008; Mount: Surface Mount; Inductance: 470nH; Packaging: Tape and Reel; Height - Seated (Max): 0.039inch; Case Code (Metric): 2520; Resistor Type: Wirewound; Shielding: Shielded
P?#2 = TSW-103-07-G-S: as P?#1 on sheet tms320f28388d_core_board_adc; ComponentLink3URL: http://www.samtec.com/documents/webfiles/cpdf/TSW-XXX-XX-XXX-X-XX-XXX-MKT.pdf; Temperature Range: -55 to 125 degC; DatasheetVersion: F-214; ComponentLink1Description: Manufacturer URL; ComponentLink2URL: http://www.samtec.com/documents/webfiles/pdf/TSW_TH.PDF; RoHS: True; Orientation: Vertical; ComponentLink2Description: Datasheet; ComponentLink3Description: Package Specification; PackageDescription: .025[0.64] SQ. Post Terminal Strip Assembly; Mounting Technology: Through-hole; PackageVersion: DM, 8/1988; ComponentLink1URL: http://www.samtec.com; PackageReference: TSW-103-07-X-S; PartNumber: TSW-103-07-G-S
R?#30 R?#34 = RC0402FR-07100KL: Manufacturer: Yageo / Phycomp; Part Number: RC0402FR-07100KL
R?#31 = ERJ-2RKF8872X: Manufacturer: Panasonic; Part Number: ERJ-2RKF8872X
R?#32 = ERJ2RKF1962X: Manufacturer: Panasonic; Part Number: ERJ-2RKF8872X
R?#33 = RC0402FR-0710KL: Manufacturer: Yageo / Phycomp; Part Number: RC0402FR-0710KL
R?#35 R?#36 = ERJ2RKF6802X: Manufacturer: Panasonic; Part Number: ERJ-2RKF8872X
R?#37 = ERJ-2RKF8061X: Manufacturer: Panasonic; Part Number: ERJ-2RKF8061X
R?#38 = RT0402BRD0756RL: RES SMD 56 OHM 0.1% 1/16W 0402; Manufacturer: Yageo; Power Rating: 0.063W; Resistance: 56Ω; Tolerance: 0.001; Value: 56Ω; Voltage Rating: 50V; Temperature Coefficient: 25 ppm/°C; Octopart: https://octopart.com/rt0402brd0756rl-yageo-1266468; Footprint Url: http://www.yageo.com/exep/pages/download/literatures/PYu-R_Mount_10.pdf; Mouser Description: Thin Film Resistors 1/16W 56 ohm .1% 25ppm; ComponentLink2URL: http://www.yageo.com/documents/recent/PYu-RT_1-to-0.01_RoHS_L_9.pdf; Category: Res; Temperature Range Low: -55°C; Device Class L2: Resistors; Series: RT; Digikey Description: RES SMD 56 OHM 0.1% 1/16W 0402; Device Class L3: Chip SMD Resistors; Composition: Thin Film; ComponentLink2Description: Datasheet; Temperature: -55°C to +155°C; Manufacturer Part Number: RT0402BRD0756RL; RoHS: TRUE; Lead Free: Yes; Package: RT0402; Temperature Range High: +155°C; Height: 0.35mm; Device Class L1: Passive Components; Ipc Land Pattern Name: RESC10050X30; Automotive: No
U?#4 U?#5 = XF28388DZWTS: as U?#1 on sheet tms320f28388d_core_board_support; TYPE: TYPE; RefDes: RefDes; Copyright: Copyright (C) 2026 Ultra Librarian. All rights reserved.; Manufacturer_Part_Number: XF28388DZWTS
U?#6 = TPS62441RQRR: 2.75-V to 6-V, dual 1-A step-down converter in QFN package 14-VQFN-HR -40 to 150; Manufacturer_Name: Texas Instruments; Type: Power Management; Copyright: Copyright (C) 2026 Ultra Librarian. All rights reserved.; Manufacturer_Part_Number: TPS62441RQRR; RefDes: RefDes

## Sheet tmf320f28388d_core_board_testpoint.SchDoc
size A3; SheetNumber: 5; SheetTotal: 5
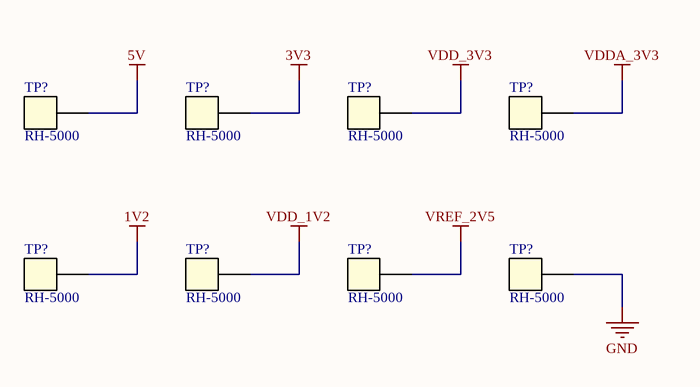
[diagram p4: tmf320f28388d_core_board_testpoint.SchDoc]

### Parts
(Parts that share a designator on the sheet are numbered #1, #2 ... from top to bottom, then left to right.)
TP?#1  RH-5000  [FP-5000-MFG]
TP?#2  RH-5000  [FP-5000-MFG]
TP?#3  RH-5000  [FP-5000-MFG]
TP?#4  RH-5000  [FP-5000-MFG]
TP?#5  RH-5000  [FP-5000-MFG]
TP?#6  RH-5000  [FP-5000-MFG]
TP?#7  RH-5000  [FP-5000-MFG]
TP?#8  RH-5000  [FP-5000-MFG]

### Nets
1V2: TP?#5.1
3V3: TP?#2.1
5V: TP?#1.1
GND: TP?#8.1
VDD_1V2: TP?#6.1
VDD_3V3: TP?#3.1
VDDA_3V3: TP?#4.1
VREF_2V5: TP?#7.1

### Library data of the parts
TP?#1-TP?#8 = RH-5000: PC TEST POINT MINIATURE RED; Outside Diameter: 2.54mm; Body Material: Bronze; Number of Contacts: 1; Insulation: Insulated; Inside Diameter: 1.27mm; Hole Diameter: 1.6mm; Plating: Silver; Length: 7.62mm; Package Quantity: 100; Number of Ports: 1; Contact Material: Bronze; Orientation: Straight; RoHS Compliant: Yes; Housing Color: Red; Height: 0.3inch; Series: THM; Lead Free: Lead Free; Color: Red; Contact Plating: Tin; Mount: PCB; Packaging: Bulk; REACH SVHC: No SVHC; Flammability Rating: UL94 V-0; Material: Nylon

## Nets that join several sheets
1V2: tms320f28388d_core_board_power (8 pins), tmf320f28388d_core_board_testpoint (TP?#5.1)
3V3: tms320f28388d_core_board_power (10 pins), tmf320f28388d_core_board_testpoint (TP?#2.1)
5V: tms320f28388d_core_board_power (13 pins), tmf320f28388d_core_board_testpoint (TP?#1.1)
GND: tms320f28388d_core_board_support (5 pins), tms320f28388d_core_board_adc (42 pins), tms320f28388d_core_board_power (142 pins), tmf320f28388d_core_board_testpoint (TP?#8.1)
VDD_1V2: tms320f28388d_core_board_power (24 pins), tmf320f28388d_core_board_testpoint (TP?#6.1)
VDD_3V3: tms320f28388d_core_board_support (FB?#1.1 R?#3.1), tms320f28388d_core_board_adc (R?#4.2), tms320f28388d_core_board_power (66 pins), tmf320f28388d_core_board_testpoint (TP?#3.1)
VDDA_3V3: tms320f28388d_core_board_adc (12 pins), tms320f28388d_core_board_power (6 pins), tmf320f28388d_core_board_testpoint (TP?#4.1)
VREF_2V5: tms320f28388d_core_board_adc (9 pins), tms320f28388d_core_board_power (5 pins), tmf320f28388d_core_board_testpoint (TP?#7.1)